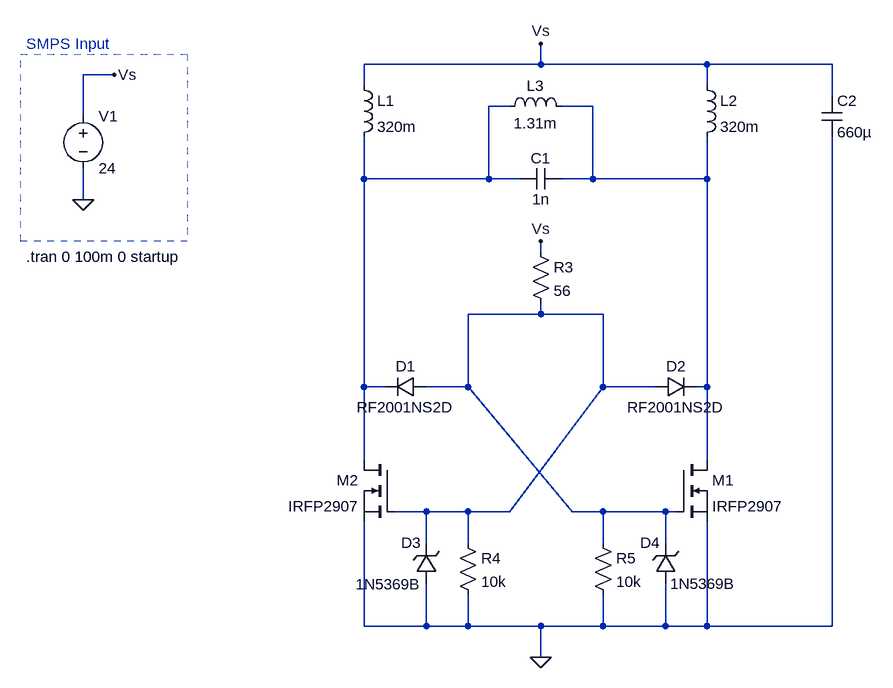
[diagram p0: schematic ZVS_Loader.asc]
ZVS_Loader.asc, the LTspice schematic file:
Version 4
SHEET 1 880 948
WIRE 256 16 256 -16
WIRE 256 16 -16 16
WIRE 512 16 256 16
WIRE 704 16 512 16
WIRE -400 32 -448 32
WIRE -16 48 -16 16
WIRE 512 48 512 16
WIRE 704 64 704 16
WIRE 208 80 176 80
WIRE 336 80 288 80
WIRE -448 96 -448 32
WIRE -16 192 -16 128
WIRE 176 192 176 80
WIRE 176 192 -16 192
WIRE 224 192 176 192
WIRE 336 192 336 80
WIRE 336 192 288 192
WIRE 512 192 512 128
WIRE 512 192 336 192
WIRE -448 224 -448 176
WIRE 256 304 256 288
WIRE 256 400 256 384
WIRE 256 400 144 400
WIRE 352 400 256 400
WIRE -16 512 -16 192
WIRE 16 512 -16 512
WIRE 144 512 144 400
WIRE 144 512 80 512
WIRE 352 512 352 400
WIRE 432 512 352 512
WIRE 512 512 512 192
WIRE 512 512 496 512
WIRE -16 624 -16 512
WIRE 512 624 512 512
WIRE 80 704 32 704
WIRE 144 704 80 704
WIRE 208 704 352 512
WIRE 208 704 144 704
WIRE 304 704 144 512
WIRE 352 704 304 704
WIRE 448 704 352 704
WIRE 464 704 448 704
WIRE 80 752 80 704
WIRE 144 752 144 704
WIRE 352 752 352 704
WIRE 448 752 448 704
WIRE -16 880 -16 720
WIRE 80 880 80 816
WIRE 80 880 -16 880
WIRE 144 880 144 832
WIRE 144 880 80 880
WIRE 256 880 144 880
WIRE 352 880 352 832
WIRE 352 880 256 880
WIRE 448 880 448 816
WIRE 448 880 352 880
WIRE 512 880 512 720
WIRE 512 880 448 880
WIRE 704 880 704 128
WIRE 704 880 512 880
WIRE 256 928 256 880
FLAG 256 -16 Vs
FLAG 256 288 Vs
FLAG 256 928 0
FLAG -400 32 Vs
FLAG -448 224 0
SYMBOL ind -32 32 R0
SYMATTR InstName L1
SYMATTR Value 320m
SYMBOL ind 496 32 R0
SYMATTR InstName L2
SYMATTR Value 320m
SYMBOL ind 192 96 R270
WINDOW 0 32 56 VTop 2
WINDOW 3 5 56 VBottom 2
SYMATTR InstName L3
SYMATTR Value 1.31m
SYMBOL cap 288 176 R90
WINDOW 0 0 32 VBottom 2
WINDOW 3 32 32 VTop 2
SYMATTR InstName C1
SYMATTR Value 1n
SYMBOL diode 80 496 R90
WINDOW 0 0 32 VBottom 2
WINDOW 3 32 32 VTop 2
SYMATTR InstName D1
SYMATTR Value RF2001NS2D
SYMBOL res 240 288 R0
SYMATTR InstName R3
SYMATTR Value 56
SYMBOL nmos 464 624 R0
SYMATTR InstName M1
SYMATTR Value IRFP2907
SYMBOL nmos 32 624 M0
SYMATTR InstName M2
SYMATTR Value IRFP2907
SYMBOL res 128 736 R0
SYMATTR InstName R4
SYMATTR Value 10k
SYMBOL res 336 736 R0
SYMATTR InstName R5
SYMATTR Value 10k
SYMBOL zener 96 816 R180
WINDOW 0 24 64 Left 2
WINDOW 3 24 0 Left 2
SYMATTR InstName D3
SYMATTR Value 1N5369B
SYMATTR Description Diode
SYMATTR Type diode
SYMBOL voltage -448 80 R0
WINDOW 123 0 0 Left 0
WINDOW 39 0 0 Left 0
SYMATTR InstName V1
SYMATTR Value 24
SYMBOL diode 432 528 R270
WINDOW 0 32 32 VTop 2
WINDOW 3 0 32 VBottom 2
SYMATTR InstName D2
SYMATTR Value RF2001NS2D
SYMBOL zener 464 816 R180
WINDOW 0 24 64 Left 2
WINDOW 3 -92 1 Left 2
SYMATTR InstName D4
SYMATTR Value 1N5369B
SYMATTR Description Diode
SYMATTR Type diode
SYMBOL cap 688 64 R0
SYMATTR InstName C2
SYMATTR Value 660µ
TEXT -536 -16 Left 2 ;SMPS Input
TEXT -536 312 Left 2 !.tran 0 100m 0 startup
RECTANGLE Normal -288 288 -544 0 1

The netlist it stands for:
* ZVS_Loader.asc
L1 Vs N001 320m
L2 Vs N002 320m
L3 N001 N002 1.31m
C1 N002 N001 1n
D1 N003 N001 RF2001NS2D
R3 Vs N003 56
M1 N002 N003 0 0 IRFP2907
M2 N001 N003 0 0 IRFP2907
R4 N003 0 10k
R5 N003 0 10k
D3 0 N003 1N5369B
V1 Vs 0 24
D2 N003 N002 RF2001NS2D
D4 0 N003 1N5369B
C2 Vs 0 660µ
.model D D
.lib standard.dio
.model NMOS NMOS
.model PMOS PMOS
.lib standard.mos
* SMPS Input
.tran 0 100m 0 startup
.backanno
.end